# EAGLE schematic ACS770 breakout v0.2 (EAGLE 9.2.2)
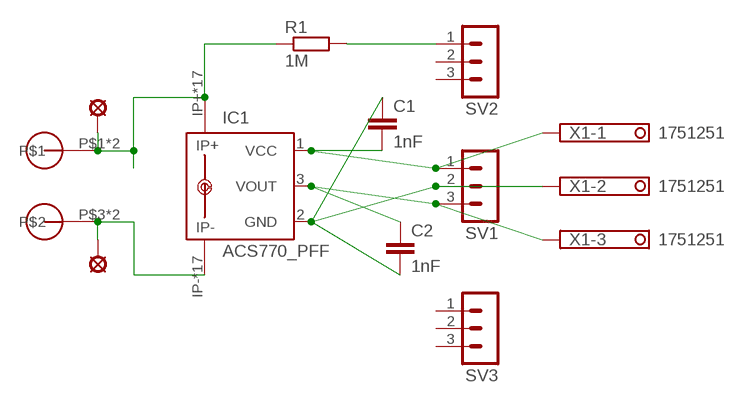
[diagram p0: schematic, sheet 1]

## Parts
C1  1nF  C-EU025-025X050  [C025-025X050]
C2  1nF  C-EU025-025X050  [C025-025X050]
IC1  ACS770_PFF  ACS758LCB-050B-PFF-T  [CB-PFF]
LSP1  LSP13  [LSP13]
LSP2  LSP13  [LSP13]
R1  1M  R-EU_0411/15  [0411/15]
SV1  MA03-1  [MA03-1]
SV2  MA03-1  [MA03-1]
SV3  MA03-1  [MA03-1]
U$5  MOLEX_39970-003  [2/10,16]
X1  1751251  [1751251]

## Nets
GND: C1.1 C2.2 IC1.2(GND) SV1.2 X1.2
N$1: C1.2 IC1.1(VCC) SV1.1 X1.1
N$2: R1.2 SV2.1
N$3: C2.1 IC1.3(VOUT) SV1.3 X1.3
N$4: IC1.IP- IC1.IP-@2(IP-) IC1.IP-@3(IP-) IC1.IP-@4(IP-) IC1.IP-@5(IP-) IC1.IP-@6(IP-) IC1.IP-@7(IP-) IC1.IP-@8(IP-) IC1.IP-@9(IP-) IC1.IP-@10(IP-) IC1.IP-@11(IP-) IC1.IP-@12(IP-) IC1.IP-@13(IP-) IC1.IP-@14(IP-) IC1.IP-@15(IP-) IC1.IP-@16(IP-) IC1.IP-@17(IP-) LSP2.MP U$5.P$3 U$5.P$4
N$5: IC1.IP+ IC1.IP+@2(IP+) IC1.IP+@3(IP+) IC1.IP+@4(IP+) IC1.IP+@5(IP+) IC1.IP+@6(IP+) IC1.IP+@7(IP+) IC1.IP+@8(IP+) IC1.IP+@9(IP+) IC1.IP+@10(IP+) IC1.IP+@11(IP+) IC1.IP+@12(IP+) IC1.IP+@13(IP+) IC1.IP+@14(IP+) IC1.IP+@15(IP+) IC1.IP+@16(IP+) IC1.IP+@17(IP+) LSP1.MP R1.1 U$5.P$1 U$5.P$2
Unconnected: SV2.2 SV2.3 SV3.1 SV3.2 SV3.3

## Library data of the parts
C1 C2 = rcl7:C-EU: CAPACITOR, European symbol
IC1 = allegro:ACS758*: Thermally Enhanced, Fully Integrated, Hall Effect-Based Linear Current Sensor with 100 micro Ohm Current Conductor display layer 49 Reference in BRD and place VIAs on circles Source: http://www.allegromicro.com/en/Products/Part_Numbers/0758/0758.pdf; MPN: ACS758LCB-050B-PFF-T; OC_FARNELL: 1718997; OC_NEWARK: 04R7131
LSP1 LSP2 = solpad:LSP13: SOLDER PAD drill 1.3 mm, distributor Buerklin, 12H562
R1 = rcl:R-EU_: RESISTOR, European symbol
SV1-SV3 = con-lstb:MA03-1: PIN HEADER; OC_FARNELL: unknown; OC_NEWARK: unknown
U$5 = 10.16mm terminal block:MOLEX_39970-003
X1 = con-phoenix-350:1751251: MKDS 1/ 3-3,5 Printklemme Nennstrom: 10 A Bemessungsspannung: 160 V Raster: 3,5 mm Polzahl: 3 Montageart: Löten Anschlussart: Schraubanschluss Anschlussrichtung vom Leiter zur Platine: 0° Source: http://eshop.phoenixcontact.com .. 1751251.pdf; OC_FARNELL: unknown; OC_NEWARK: unknown